# Altium project Khanh_DATN_GW.PrjPcb
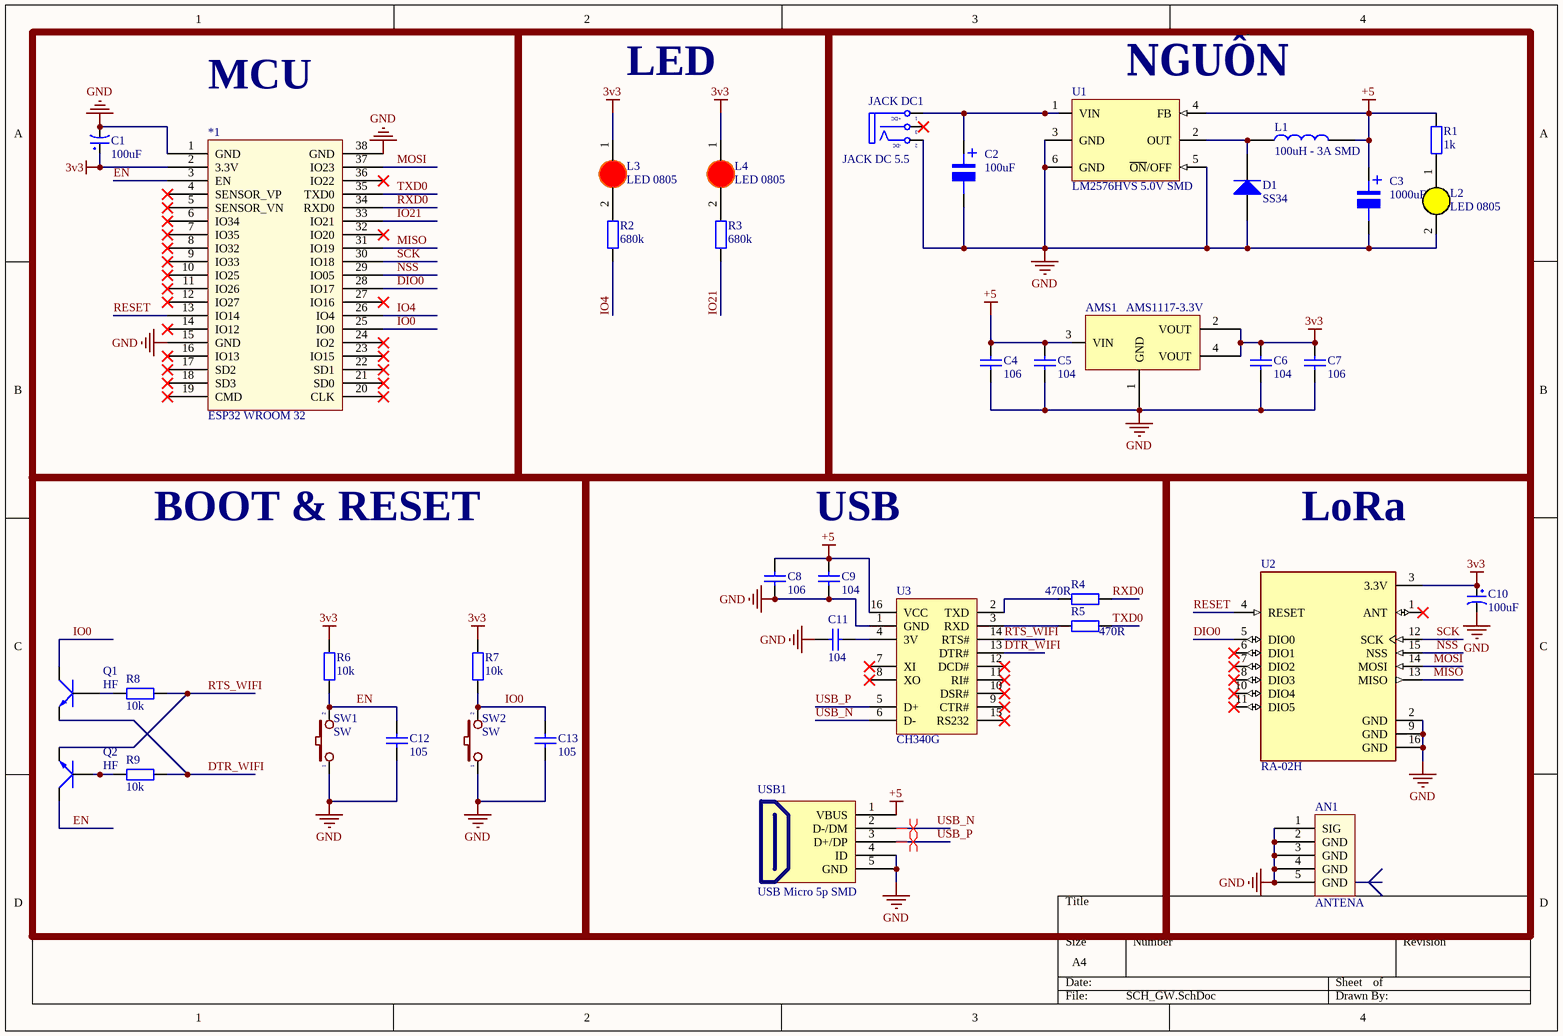
[diagram p0: SCH_GW.SchDoc]
1 sheet, 39 parts. Net scope: global (net labels, ports and power ports of the same name join across sheets).
Board file: PCB_GW.PcbDoc

## Sheet SCH_GW.SchDoc
size A4; SheetNumber: 1; SheetTotal: 1

### Parts
*1  ESP32 WROOM 32  [ESP32-WROOM-32D]
AMS1  AMS1117-3.3V  [SOT223]
AN1  ANTENA  [DE ANTEN SMA CONG]
C1  100uF  [tu tantalum smd3528]
C2  100uF  [tu nhom 10 (g)]
C3  1000uF  [tu nhom 10 (G)]
C4  106  [tu 0805]
C5  104  [tu 0805]
C6  104  [tu 0805]
C7  106  [tu 0805]
C8  106  [tu 0805]
C9  104  [tu 0805]
C10  100uF  [tu tantalum smd3528]
C11  104  [tu 0805]
C12  105  [tu 0805]
C13  105  [tu 0805]
D1  SS34  [DIODE SMA]
JACK_DC1  JACK DC 5.5  [JACK DC 5.5]
L1  100uH - 3A SMD  [Cuon Cam 12x12x10]
L2  LED 0805  [LED-0805-Yellow]
L3  LED 0805  [LED-0805-Red]
L4  LED 0805  [LED-0805-Red]
Q1  HF  [SOT23]
Q2  HF  [SOT23]
R1  1k  [tro smd 0805]
R2  680k  [Tro SMD 0805]
R3  680k  [Tro SMD 0805]
R4  470R  [Tro SMD 0805]
R5  470R  [Tro SMD 0805]
R6  10k  [tro smd 0805]
R7  10k  [tro smd 0805]
R8  10k  [tro smd 0805]
R9  10k  [tro smd 0805]
SW1  SW  [SW1-DIP]
SW2  SW  [SW1-DIP]
U1  LM2576HVS 5.0V SMD  [TO263-5]
U2  RA-02H  [XCVR_RA-01H]
U3  CH340G  [SO16]
USB1  USB Micro 5p SMD  [USB Micro 5p SMD]

### Blocks framed on the sheet
MCU: *1 C1
LED: L3 L4 R2 R3
NGUỒN: AMS1 C2-C7 D1 JACK_DC1 L1 L2 R1 U1
BOOT & RESET: C12 C13 Q1 Q2 R6-R9 SW1 SW2
USB: C8 C9 C11 R4 R5 U3 USB1
LoRa: AN1 C10 U2

### Nets
3v3: *1.2(3.3V) AMS1.2(VOUT) AMS1.4(VOUT) C1.1 C6.1 C7.1 C10.1 L3.1(A) L4.1(A) R6.2 R7.2 U2.3(3.3V)
+5: AMS1.3(VIN) C3.1 C4.1 C5.1 C8.1 C9.1 L1.2 R1.2 U1.4(FB) U3.16(VCC) USB1.1(VBUS)
GND: *1.1(GND) *1.15(GND) *1.38(GND) AMS1.1(GND) AN1.1(SIG) AN1.2(GND) AN1.3(GND) AN1.4(GND) AN1.5(GND) C1.2 C2.2 C3.2 C4.2 C5.2 C6.2 C7.2 C8.2 C9.2 C10.2 C11.2 C12.2 C13.2 D1.1(A) JACK_DC1.2(TN) L2.2(K) SW1.1 SW2.1 U1.3(GND) U1.5(~{ON}/OFF) U1.6(GND) U2.2(GND) U2.9(GND) U2.16(GND) U3.1(GND) USB1.4(ID) USB1.5(GND)
DIO0: *1.28(IO17) U2.5(DIO0)
DTR_WIFI: Q1.2(E) R9.2 U3.13(DTR#)
EN: *1.3(EN) C12.1 Q2.3(C) R6.1 SW1.2
IO0: *1.25(IO0) C13.1 Q1.3(C) R7.1 SW2.2
IO4: *1.26(IO4) R2.1
IO21: *1.33(IO21) R3.1
MISO: *1.31(IO19) U2.13(MISO)
MOSI: *1.37(IO23) U2.14(MOSI)
NSS: *1.29(IO05) U2.15(NSS)
RESET: *1.13(IO14) U2.4(RESET)
RTS_WIFI: Q2.2(E) R8.2 U3.14(RTS#)
RXD0: *1.34(RXD0) R4.2
SCK: *1.30(IO18) U2.12(SCK)
TXD0: *1.35(TXD0) R5.2
USB_N: U3.6(D-) USB1.2(D-/DM)
USB_P: U3.5(D+) USB1.3(D+/DP)
NetC2_1: C2.1 JACK_DC1.1(T) U1.1(VIN)
NetC11_1: C11.1 U3.4(3V)
NetD1_2: D1.2(K) L1.1 U1.2(OUT)
NetL2_1: L2.1(A) R1.1
NetL3_2: L3.2(K) R2.2
NetL4_2: L4.2(K) R3.2
NetQ1_1: Q1.1(B) R8.1
NetQ2_1: Q2.1(B) R9.1
NetR4_1: R4.1 U3.2(TXD)
NetR5_1: R5.1 U3.3(RXD)

Not connected (* = marked no-connect by the designer): *1 4(SENSOR_VP)* 5(SENSOR_VN)* 6(IO34)* 7(IO35)* 8(IO32)* 9(IO33)* 10(IO25)* 11(IO26)* 12(IO27)* 14(IO12)* 16(IO13)* 17(SD2)* 18(SD3)* 19(CMD)* 20(CLK)* 21(SD0)* 22(SD1)* 23(IO15)* 24(IO2)* 27(IO16)* 32(IO20)* 36(IO22)*; JACK_DC1 3(S)*; U2 1(ANT)* 6(DIO1)* 7(DIO2)* 8(DIO3)* 10(DIO4)* 11(DIO5)*; U3 7(XI)* 8(XO)* 9(CTR#)* 10(DSR#)* 11(RI#)* 12(DCD#)* 15(RS232)*

### Layout directives
differential pair: USB_N, USB_P

### Notes on the sheet
- (in symbol JACK DC 5.5) +DC; -DC
- (in symbol Tu Nhom 100uF 35V) +
- (in symbol Tu Nhom 1000uF 10V) +

### Library data of the parts
AMS1 = AMS1117 SMD: Dán; Value: AMS1117-3.3V SOT223; Don_Vi: Con; Ma_Hang: MH000596; Ghi_Chu: *; Kieu_Chan: *; Chung_Loai: Dán
AN1 = ANTEN SMA CONG: Generic Antenna
C1 C10 = Tu tantalum 100uF 6.3V SMD3528: Dán; Don_Vi: Con; So_Chan: 2; Ten_Linh_Kien: Tụ tantalum 107J-100uF 6.3V SMD3528; Ma_Hang: MH007595; Chung_Loai: Dán; Kieu_Chan: *
C2 = Tu Nhom 100uF 35V: Dán; Don_Vi: Con; Ten_Linh_Kien: Tụ Nhôm 100uF 35V; Ma_Hang: MH004019; So_Chan: 2; Chung_Loai: Dán; Kieu_Chan: *
C3 = Tu Nhom 1000uF 10V: Dán; So_Chan: 2; Don_Vi: Con; Ten_Linh_Kien: Tụ Nhôm 1000uF 10V; Ma_Hang: MH007515; Chung_Loai: Dán; Kieu_Chan: *
C4 C7 C8 = Tu 0805 106 16V 10%: Dán; Ten_Linh_Kien: Tụ 0805 106-10uF 10% 16V; So_Chan: 2; Don_Vi: Con; Ma_Hang: MH004553; Chung_Loai: Dán; Kieu_Chan: *
C5 C6 C9 C11 = Tu 0805 104 50V 10%: Dán; Don_Vi: Con; So_Chan: 2; Ten_Linh_Kien: Tụ 0805 104-100nF 10% 50V; Ma_Hang: MH004551; Chung_Loai: Dán; Kieu_Chan: *
C12 C13 = Tu 0805 105 50V 10%: Dán; Don_Vi: Con; So_Chan: 2; Ten_Linh_Kien: Tụ 0805 105-1uF 10% 50V; Ma_Hang: MH004552; Chung_Loai: Dán; Kieu_Chan: *
D1 = Diode SS34 ( 1N5822 ): Dán; Don_Vi: Con; Ma_Hang: MH002104; Ten_Linh_Kien: Diode SS34 3A 40V SMA ( 1N5822 SS34A); Kieu_Chan: *; Chung_Loai: Dán
JACK_DC1 = JACK DC 5.5: Value: Jac DC
L1 = CUON CAM 100uH SMD: Dán; Don_Vi: Con; Ma_Hang: MH003999; Ten_Linh_Kien: Cuộn Cảm 100uH 7x7x4MM CD74; Ma_Hang: *; Kieu_Chan: *; Chung_Loai: Dán
L2 = LED 0805 Vang: Dán; Don_Vi: Con; Ma_Hang: MH002329; Ten_Linh_Kien: LED 0805 Màu Vàng ( Yellow); Ghi_Chu: *; Kieu_Chan: *; Chung_Loai: Dán
L3 L4 = LED 0805 Do: Dán; Don_Vi: Con; Ma_Hang: MH000897; Ten_Linh_Kien: LED 0805 Màu Đỏ (Red); Ghi_Chu: *; Kieu_Chan: *; Chung_Loai: Dán
Q1 Q2 = C1815 HF SMD: NPN transistor; Value: C9014
R1 = Tro 0805 1% 1k: Dán; Don_Vi: Con; So_Chan: 2; Ten_Linh_Kien: Trở 0805 1% 1k; Ma_Hang: MH005468; Chung_Loai: Dán; Kieu_Chan: *
R2 R3 = Tro 0805 5% 680k: Dán; Don_Vi: Con; Ma_Hang: MH005343; Ten_Linh_Kien: Trở 0805 5% 680k; So_Chan: 2; Chung_Loai: Dán; Kieu_Chan: *
R4 R5 = Tro 0805 5% 470R: Dán; Don_Vi: Con; Ma_Hang: MH005341; Ten_Linh_Kien: Trở 0805 5% 470R; So_Chan: 2; Chung_Loai: Dán; Kieu_Chan: *
R6-R9 = Tro 0805 1% 10k: Dán; Don_Vi: Con; So_Chan: 2; Ten_Linh_Kien: Trở 0805 1% 10k; Ma_Hang: MH005473; Chung_Loai: Dán; Kieu_Chan: *
SW1 SW2 = SW2: Switch button 2 pin; Value: SW chip 2 pin
U1 = LM2576HVS 5.0V SMD: Dán; Ten_Linh_Kien: LM2576HVS-5.0V BUCK 5V 3A TO263-5; Don_Vi: Con; Ma_Hang: MH002362; Ghi_Chu: *; Kieu_Chan: *; Chung_Loai: Dán
U2 = RA-02H: Ai-Thinker Lora Series Module; MP: RA-01H; SnapEDA_Link: https://www.snapeda.com/parts/RA-01H/AI-Thinker/view-part/?ref=snap; MF: AI-Thinker; Check_prices: https://www.snapeda.com/parts/RA-01H/AI-Thinker/view-part/?ref=eda; Value: *; Availability: Not in stock; Price: None; Package: Package
U3 = CH340G: High and Low Side Driver; Note: Pins 4, 8 and 14 are not connected; Published: 8-Jun-2000; LatestRevisionDate: 04-Mar-2005; LatestRevisionNote: Stylized 3D Model Added.; DatasheetVersion: PD60147J; PackageReference: PDIP14; Publisher: Altium Limited; PackageDescription: DIP; 14 Leads; Row Spacing 7.62 mm; Pitch 2.54 mm; ComponentLink1Description: Manufacturer Link; ComponentLink1URL: http://www.irf.com/; ComponentLink2Description: Datasheet; ComponentLink2URL: http://www.irf.com/product-info/datasheets/data/ir2110.pdf
USB1 = USB Micro 5p SMD: USB Type B; Ten: MicroUSB MK5P SMD; Ma_Hang: MH001020